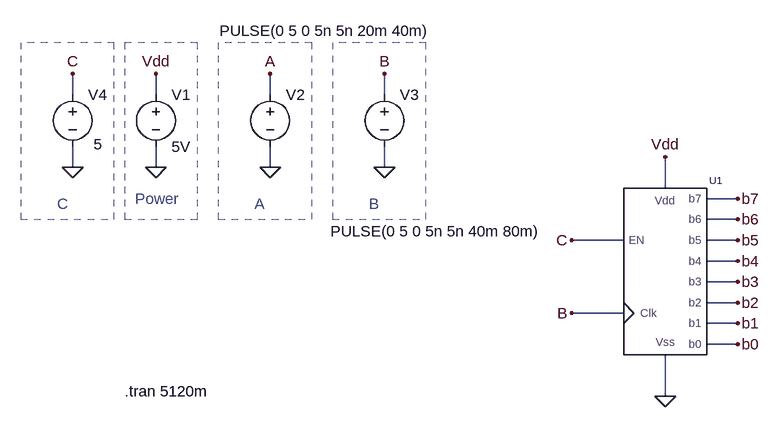
[diagram p0: schematic counter_8_bit_block.asc]
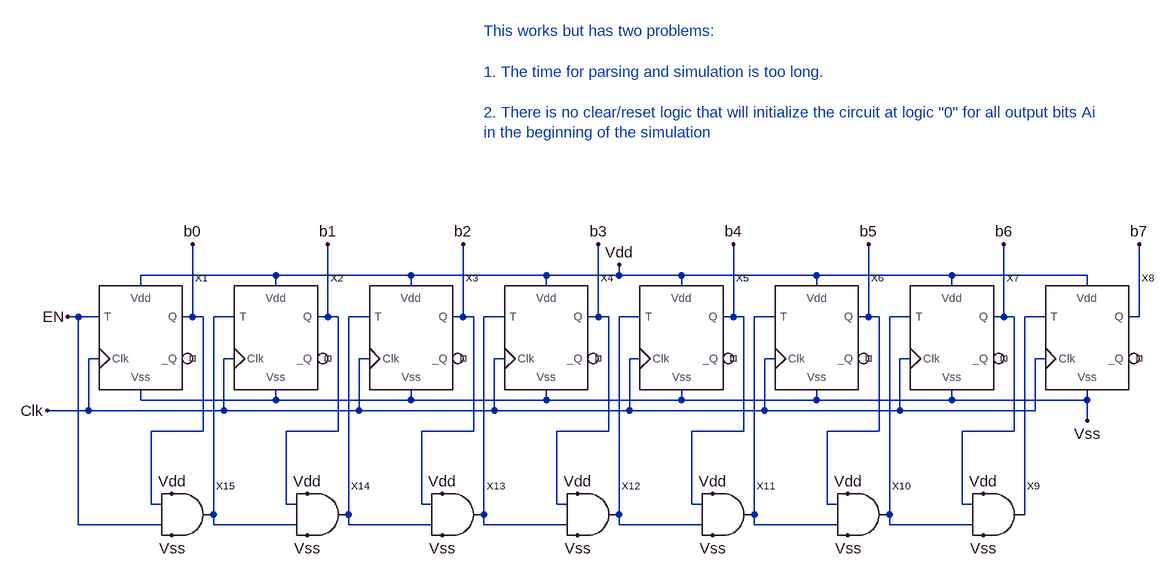
[diagram p1: sub-circuit counter_8_bit.asc]
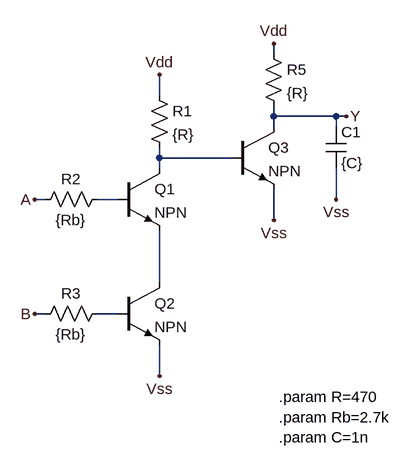
[diagram p2: sub-circuit and.asc]
counter_8_bit_block.asc, the LTspice schematic file:
Version 4
SHEET 1 880 680
WIRE -688 -416 -688 -448
WIRE -560 -416 -560 -448
WIRE -384 -416 -384 -448
WIRE -208 -416 -208 -448
WIRE -688 -304 -688 -336
WIRE -560 -304 -560 -336
WIRE -384 -304 -384 -336
WIRE -208 -304 -208 -336
WIRE 224 -272 224 -320
WIRE 336 -256 288 -256
WIRE 336 -224 288 -224
WIRE 160 -192 80 -192
WIRE 336 -192 288 -192
WIRE 336 -160 288 -160
WIRE 336 -128 288 -128
WIRE 336 -96 288 -96
WIRE 160 -80 80 -80
WIRE 336 -64 288 -64
WIRE 336 -32 288 -32
WIRE 224 48 224 -16
FLAG 80 -192 C
FLAG 224 -320 Vdd
FLAG 224 48 0
FLAG -560 -304 0
FLAG -560 -448 Vdd
FLAG -384 -304 0
FLAG -384 -448 A
FLAG 80 -80 B
FLAG -208 -304 0
FLAG -208 -448 B
FLAG -688 -304 0
FLAG -688 -448 C
FLAG 336 -32 b0
FLAG 336 -64 b1
FLAG 336 -96 b2
FLAG 336 -128 b3
FLAG 336 -160 b4
FLAG 336 -192 b5
FLAG 336 -224 b6
FLAG 336 -256 b7
SYMBOL voltage -560 -432 R0
WINDOW 123 0 0 Left 0
WINDOW 39 0 0 Left 0
SYMATTR InstName V1
SYMATTR Value 5V
SYMBOL voltage -384 -432 R0
WINDOW 123 0 0 Left 0
WINDOW 39 0 0 Left 0
WINDOW 3 -78 -82 Left 2
SYMATTR Value PULSE(0 5 0 5n 5n 20m 40m)
SYMATTR InstName V2
SYMBOL voltage -208 -432 R0
WINDOW 123 0 0 Left 0
WINDOW 39 0 0 Left 0
WINDOW 3 -83 226 Left 2
SYMATTR Value PULSE(0 5 0 5n 5n 40m 80m)
SYMATTR InstName V3
SYMBOL voltage -688 -432 R0
WINDOW 123 0 0 Left 0
WINDOW 39 0 0 Left 0
WINDOW 3 32 92 Left 2
SYMATTR Value 5
SYMATTR InstName V4
SYMBOL counter_8_bit 160 -16 R0
SYMATTR InstName U1
TEXT -592 -256 Left 2 ;Power
TEXT -408 -248 Left 2 ;A
TEXT -608 40 Left 2 !.tran 5120m
TEXT -232 -248 Left 2 ;B
TEXT -712 -248 Left 2 ;C
RECTANGLE Normal -496 -496 -608 -224 2
RECTANGLE Normal -320 -496 -464 -224 2
RECTANGLE Normal -144 -496 -288 -224 2
RECTANGLE Normal -624 -496 -768 -224 2

counter_8_bit.asc, the sub-circuit schematic file:
Version 4
SHEET 1 992 680
WIRE -688 -32 -896 -32
WIRE -480 -32 -688 -32
WIRE -272 -32 -480 -32
WIRE -160 -32 -160 -48
WIRE -160 -32 -272 -32
WIRE -64 -32 -160 -32
WIRE 144 -32 -64 -32
WIRE 352 -32 144 -32
WIRE 560 -32 352 -32
WIRE -896 -16 -896 -32
WIRE -688 -16 -688 -32
WIRE -480 -16 -480 -32
WIRE -272 -16 -272 -32
WIRE -64 -16 -64 -32
WIRE 144 -16 144 -32
WIRE 352 -16 352 -32
WIRE 560 -16 560 -32
WIRE -992 32 -1008 32
WIRE -960 32 -992 32
WIRE -816 32 -816 -80
WIRE -816 32 -832 32
WIRE -800 32 -816 32
WIRE -752 32 -784 32
WIRE -608 32 -608 -80
WIRE -608 32 -624 32
WIRE -592 32 -608 32
WIRE -544 32 -576 32
WIRE -400 32 -400 -80
WIRE -400 32 -416 32
WIRE -384 32 -400 32
WIRE -336 32 -368 32
WIRE -192 32 -192 -80
WIRE -192 32 -208 32
WIRE -176 32 -192 32
WIRE -128 32 -160 32
WIRE 16 32 16 -80
WIRE 16 32 0 32
WIRE 32 32 16 32
WIRE 80 32 48 32
WIRE 224 32 224 -80
WIRE 224 32 208 32
WIRE 240 32 224 32
WIRE 288 32 256 32
WIRE 432 32 432 -80
WIRE 432 32 416 32
WIRE 448 32 432 32
WIRE 496 32 464 32
WIRE 640 32 640 -80
WIRE 640 32 624 32
WIRE -960 96 -976 96
WIRE -752 96 -768 96
WIRE -544 96 -560 96
WIRE -336 96 -352 96
WIRE -128 96 -144 96
WIRE 80 96 64 96
WIRE 288 96 272 96
WIRE 496 96 480 96
WIRE -896 160 -896 144
WIRE -688 160 -688 144
WIRE -688 160 -896 160
WIRE -480 160 -480 144
WIRE -480 160 -688 160
WIRE -272 160 -272 144
WIRE -272 160 -480 160
WIRE -64 160 -64 144
WIRE -64 160 -272 160
WIRE 144 160 144 144
WIRE 144 160 -64 160
WIRE 352 160 352 144
WIRE 352 160 144 160
WIRE 560 160 560 144
WIRE 560 160 352 160
WIRE -976 176 -976 96
WIRE -976 176 -1040 176
WIRE -768 176 -768 96
WIRE -768 176 -976 176
WIRE -560 176 -560 96
WIRE -560 176 -768 176
WIRE -352 176 -352 96
WIRE -352 176 -560 176
WIRE -144 176 -144 96
WIRE -144 176 -352 176
WIRE 64 176 64 96
WIRE 64 176 -144 176
WIRE 272 176 272 96
WIRE 272 176 64 176
WIRE 480 176 480 96
WIRE 480 176 272 176
WIRE 560 192 560 160
WIRE -800 208 -800 32
WIRE -800 208 -880 208
WIRE -592 208 -592 32
WIRE -592 208 -672 208
WIRE -384 208 -384 32
WIRE -384 208 -464 208
WIRE -176 208 -176 32
WIRE -176 208 -256 208
WIRE 32 208 32 32
WIRE 32 208 -48 208
WIRE 240 208 240 32
WIRE 240 208 160 208
WIRE 448 208 448 32
WIRE 448 208 368 208
WIRE -880 320 -880 208
WIRE -864 320 -880 320
WIRE -672 320 -672 208
WIRE -656 320 -672 320
WIRE -464 320 -464 208
WIRE -448 320 -464 320
WIRE -256 320 -256 208
WIRE -240 320 -256 320
WIRE -48 320 -48 208
WIRE -32 320 -48 320
WIRE 160 320 160 208
WIRE 176 320 160 320
WIRE 368 320 368 208
WIRE 384 320 368 320
WIRE -784 336 -784 32
WIRE -576 336 -576 32
WIRE -368 336 -368 32
WIRE -160 336 -160 32
WIRE 48 336 48 32
WIRE 256 336 256 32
WIRE 464 336 464 32
WIRE -992 352 -992 32
WIRE -864 352 -992 352
WIRE -784 352 -784 336
WIRE -656 352 -784 352
WIRE -576 352 -576 336
WIRE -448 352 -576 352
WIRE -368 352 -368 336
WIRE -240 352 -368 352
WIRE -160 352 -160 336
WIRE -32 352 -160 352
WIRE 48 352 48 336
WIRE 176 352 48 352
WIRE 256 352 256 336
WIRE 384 352 256 352
FLAG -1008 32 EN
FLAG -1040 176 Clk
FLAG -160 -48 Vdd
FLAG -816 -80 b0
FLAG -608 -80 b1
FLAG -400 -80 b2
FLAG -192 -80 b3
FLAG 16 -80 b4
FLAG 224 -80 b5
FLAG 432 -80 b6
FLAG 640 -80 b7
FLAG -432 368 Vss
FLAG -224 368 Vss
FLAG -16 368 Vss
FLAG 192 368 Vss
FLAG 400 368 Vss
FLAG -640 368 Vss
FLAG -848 368 Vss
FLAG -848 304 Vdd
FLAG -640 304 Vdd
FLAG -432 304 Vdd
FLAG -224 304 Vdd
FLAG -16 304 Vdd
FLAG 192 304 Vdd
FLAG 400 304 Vdd
FLAG 560 192 Vss
SYMBOL tff_p -960 144 R0
SYMATTR InstName X1
SYMBOL tff_p -752 144 R0
SYMATTR InstName X2
SYMBOL tff_p -544 144 R0
SYMATTR InstName X3
SYMBOL tff_p -336 144 R0
SYMATTR InstName X4
SYMBOL tff_p -128 144 R0
SYMATTR InstName X5
SYMBOL tff_p 80 144 R0
SYMATTR InstName X6
SYMBOL tff_p 288 144 R0
SYMATTR InstName X7
SYMBOL tff_p 496 144 R0
SYMATTR InstName X8
SYMBOL and 384 368 R0
SYMATTR InstName X9
SYMBOL and 176 368 R0
SYMATTR InstName X10
SYMBOL and -32 368 R0
SYMATTR InstName X11
SYMBOL and -240 368 R0
SYMATTR InstName X12
SYMBOL and -448 368 R0
SYMATTR InstName X13
SYMBOL and -656 368 R0
SYMATTR InstName X14
SYMBOL and -864 368 R0
SYMATTR InstName X15
TEXT -368 -408 Left 2 ;This works but has two problems:\n \n1. The time for parsing and simulation is too long.\n \n2. There is no clear/reset logic that will initialize the circuit at logic "0" for all output bits Ai \nin the beginning of the simulation

and.asc, the sub-circuit schematic file:
Version 4
SHEET 1 880 680
WIRE -64 -224 -64 -240
WIRE -240 -160 -240 -192
WIRE -64 -128 -64 -144
WIRE 32 -128 -64 -128
WIRE 48 -128 32 -128
WIRE -64 -112 -64 -128
WIRE 32 -112 32 -128
WIRE -240 -64 -240 -80
WIRE -128 -64 -240 -64
WIRE -240 -48 -240 -64
WIRE -416 0 -432 0
WIRE -304 0 -336 0
WIRE 32 0 32 -48
WIRE -64 32 -64 -16
WIRE -240 128 -240 48
WIRE -416 176 -432 176
WIRE -304 176 -336 176
WIRE -240 272 -240 224
FLAG -240 272 Vss
FLAG -240 -192 Vdd
FLAG -432 176 B
FLAG -432 0 A
FLAG 32 0 Vss
FLAG -64 32 Vss
FLAG -64 -240 Vdd
FLAG 48 -128 Y
SYMBOL npn -304 -48 R0
SYMATTR InstName Q1
SYMBOL npn -304 128 R0
SYMATTR InstName Q2
SYMBOL res -256 -176 R0
SYMATTR InstName R1
SYMATTR Value {R}
SYMBOL res -320 -16 R90
WINDOW 0 0 56 VBottom 2
WINDOW 3 32 56 VTop 2
SYMATTR InstName R2
SYMATTR Value {Rb}
SYMBOL res -320 160 R90
WINDOW 0 0 56 VBottom 2
WINDOW 3 32 56 VTop 2
SYMATTR InstName R3
SYMATTR Value {Rb}
SYMBOL cap 16 -112 R0
SYMATTR InstName C1
SYMATTR Value {C}
SYMBOL npn -128 -112 R0
SYMATTR InstName Q3
SYMBOL res -80 -240 R0
SYMATTR InstName R5
SYMATTR Value {R}
TEXT -56 304 Left 2 !.param R=470\n.param Rb=2.7k\n.param C=1n

The netlist it stands for:
* counter_8_bit_block.asc
V1 Vdd 0 5V
V2 A 0 PULSE(0 5 0 5n 5n 20m 40m)
V3 B 0 PULSE(0 5 0 5n 5n 40m 80m)
V4 C 0 5
XU1 C B b0 b1 b2 b3 b4 b5 b6 b7 Vdd 0 counter_8_bit

* block symbol definitions
.subckt counter_8_bit EN Clk b0 b1 b2 b3 b4 b5 b6 b7 Vdd Vss
XX1 EN Clk b0 NC_01 Vdd Vss tff_p  ; pins T Clk Q _Q Vdd Vss
XX2 N001 Clk b1 NC_02 Vdd Vss tff_p  ; pins T Clk Q _Q Vdd Vss
XX3 N002 Clk b2 NC_03 Vdd Vss tff_p  ; pins T Clk Q _Q Vdd Vss
XX4 N003 Clk b3 NC_04 Vdd Vss tff_p  ; pins T Clk Q _Q Vdd Vss
XX5 N004 Clk b4 NC_05 Vdd Vss tff_p  ; pins T Clk Q _Q Vdd Vss
XX6 N005 Clk b5 NC_06 Vdd Vss tff_p  ; pins T Clk Q _Q Vdd Vss
XX7 N006 Clk b6 NC_07 Vdd Vss tff_p  ; pins T Clk Q _Q Vdd Vss
XX8 N007 Clk b7 NC_08 Vdd Vss tff_p  ; pins T Clk Q _Q Vdd Vss
XX9 b6 N006 N007 Vdd Vss and
XX10 b5 N005 N006 Vdd Vss and
XX11 b4 N004 N005 Vdd Vss and
XX12 b3 N003 N004 Vdd Vss and
XX13 b2 N002 N003 Vdd Vss and
XX14 b1 N001 N002 Vdd Vss and
XX15 b0 EN N001 Vdd Vss and
* This works but has two problems:
* 1. The time for parsing and simulation is too long.
* 2. There is no clear/reset logic that will initialize the circuit at logic "0" for all output bits Ai
* in the beginning of the simulation
.ends counter_8_bit

.subckt and A B Y Vdd Vss
Q1 N001 N002 N003 0 NPN
Q2 N003 N004 Vss 0 NPN
R1 Vdd N001 {R}
R2 N002 A {Rb}
R3 N004 B {Rb}
C1 Y Vss {C}
Q3 Y N001 Vss 0 NPN
R5 Vdd Y {R}
.param R=470
.param Rb=2.7k
.param C=1n
.ends and

.model NPN NPN
.model PNP PNP
.lib standard.bjt
* Power
* A
.tran 5120m
* B
* C
.backanno
.end